# EAGLE design board (EAGLE 6.1)
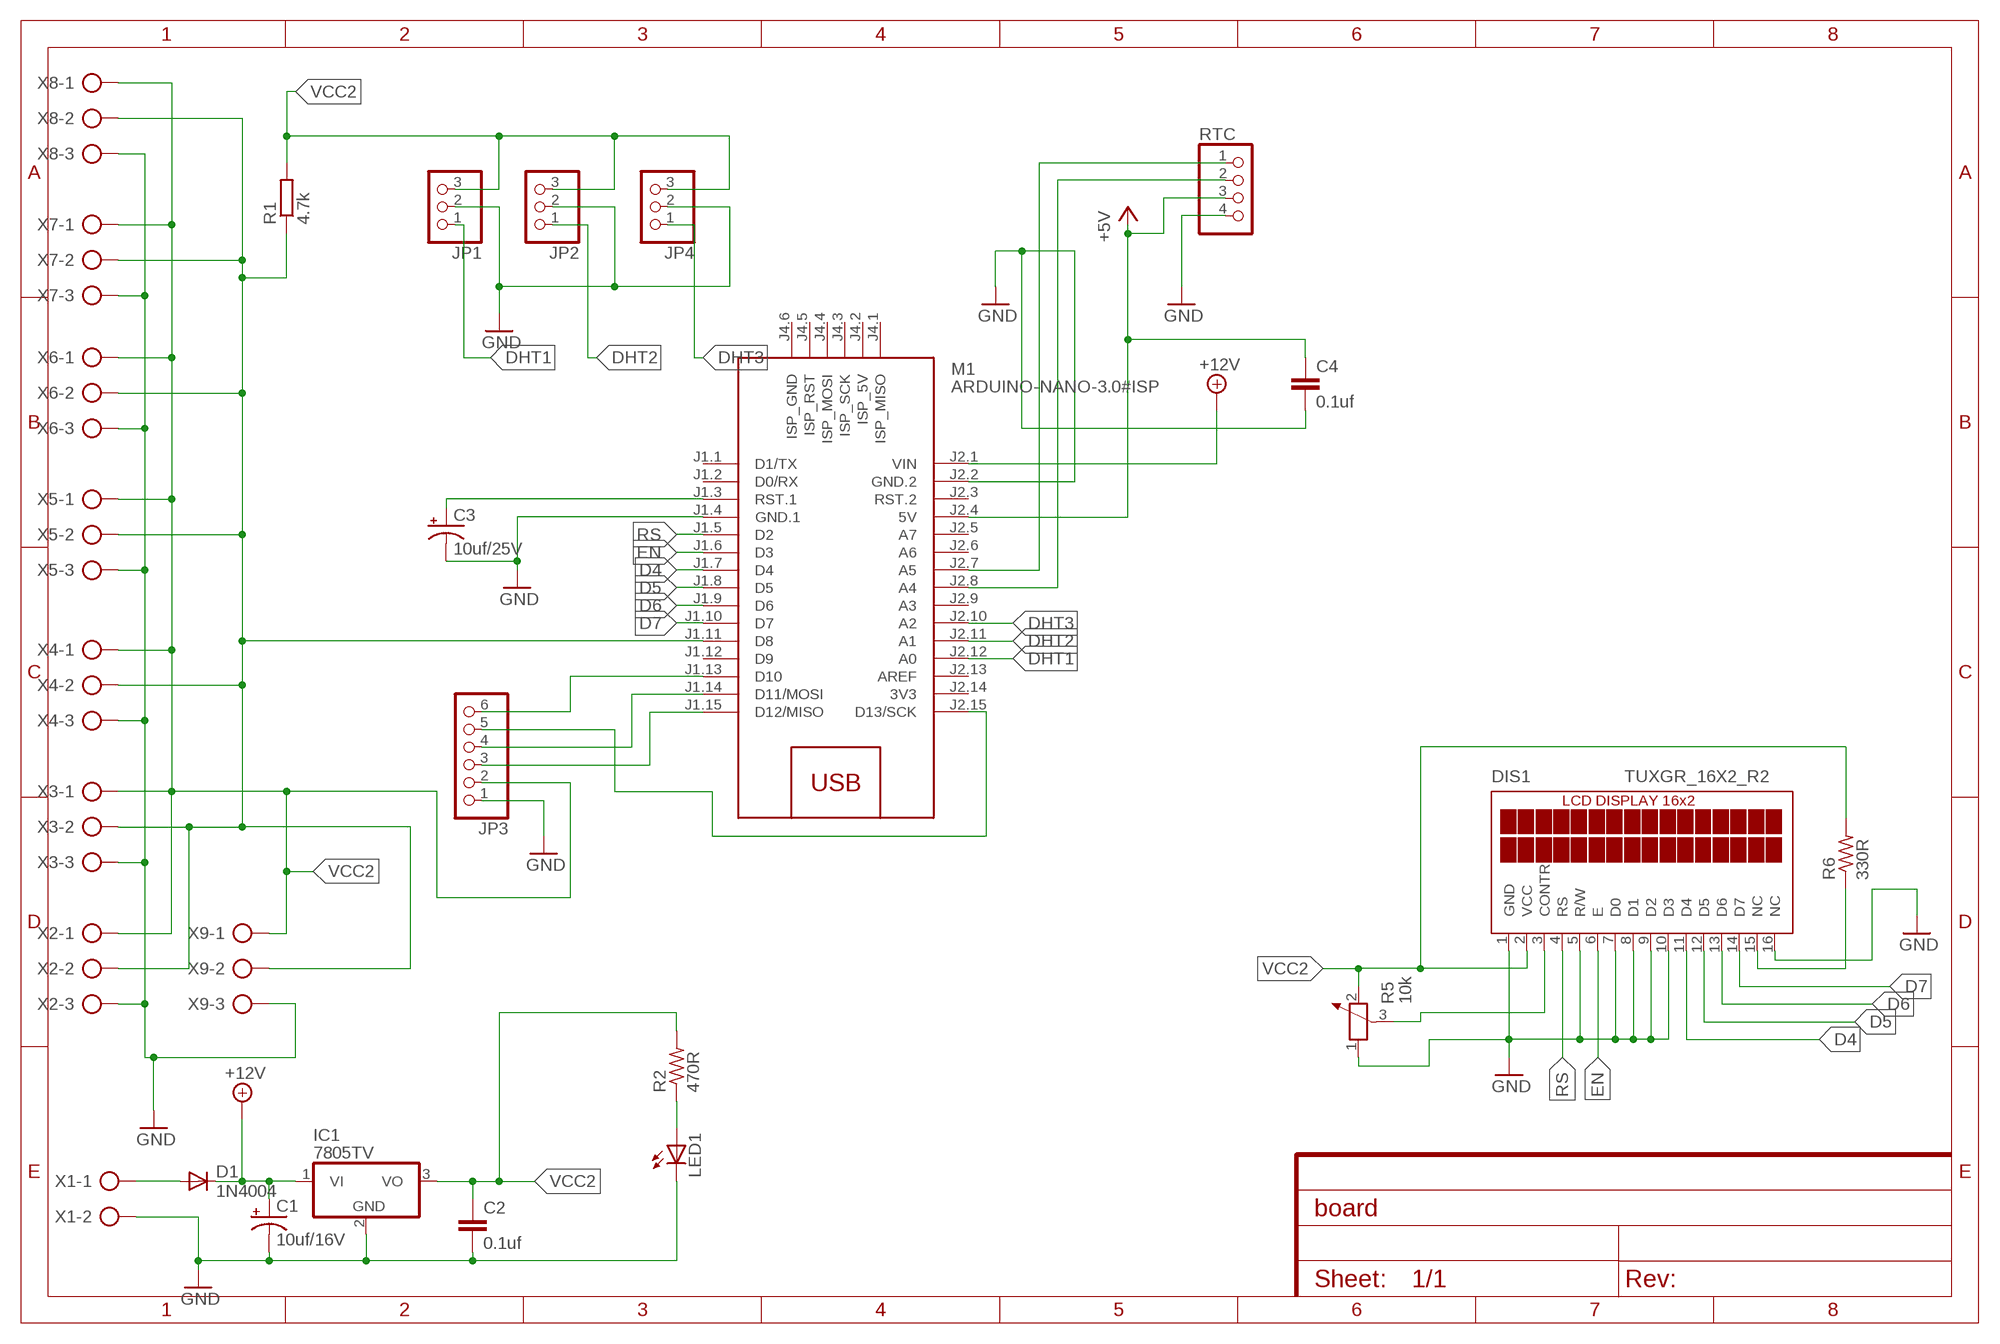
[diagram p0: schematic, sheet 1]
FRAME1 (FRAME-A4L): CNAME: DATA LOGGER NANO RTC

## Parts
C1  10uf/16V  CPOL-USE2.5-5  [E2,5-5]
C2  0.1uf  C-EU050-035X075  [C050-035X075]
C3  10uf/25V  CPOL-USE2.5-5  [E2,5-5]
C4  0.1uf  C-EU050-035X075  [C050-035X075]
D1  1N4004  [DO41-10]
DIS1  TUXGR_16X2_R2  [TUXGR_16X2_R2]
IC1  7805TV  [TO220V]
JP1  PINHD-1X3  [1X03]
JP2  PINHD-1X3  [1X03]
JP3  PINHD-1X6  [1X06]
JP4  PINHD-1X3  [1X03]
LED1  LED3MM  [LED3MM]
M1  ARDUINO-NANO-3.0#ISP  [ARDUINO-NANO-3.0#ISP]
R1  4.7k  R-EU_0207/10  [0207/10]
R2  470R  R-US_0207/10  [0207/10@1]
R5  10k  POTENTIOMETER_PT-10  [PT-10]
R6  330R  R-US_0207/10  [0207/10@1]
RTC  PINHD-1X4  [1X04]
X1  AK500/2  [AK500/2]
X2  AK500/3  [AK500/3]
X3  AK500/3  [AK500/3]
X4  AK500/3  [AK500/3]
X5  AK500/3  [AK500/3]
X6  AK500/3  [AK500/3]
X7  AK500/3  [AK500/3]
X8  AK500/3  [AK500/3]
X9  AK500/3  [AK500/3]

## Nets
+5V: C4.1 M1.J2.4(5V) RTC.3
+12V: C1.+ D1.C IC1.1(VI) M1.J2.1(VIN)
D4: DIS1.11(D4) M1.J1.7(D4)
D5: DIS1.12(D5) M1.J1.8(D5)
D6: DIS1.13(D6) M1.J1.9(D6)
D7: DIS1.14(D7) M1.J1.10(D7)
DHT1: JP1.1 M1.J2.12(A0)
DHT2: JP2.1 M1.J2.11(A1)
DHT3: JP4.1 M1.J2.10(A2)
EN: DIS1.6(E) M1.J1.6(D3)
GND: C1.- C2.2 C3.- C4.2 DIS1.1(GND) DIS1.5(R/W) DIS1.7(D0) DIS1.8(D1) DIS1.9(D2) DIS1.10(D3) DIS1.16(NC) IC1.2(GND) JP1.2 JP2.2 JP3.1 JP4.2 LED1.K(C) M1.J1.4(GND.1) M1.J2.2(GND.2) R5.1 RTC.4 X1.2 X2.3 X3.3 X4.3 X5.3 X6.3 X7.3 X8.3 X9.3
N$2: D1.A X1.1
N$3: C3.+ M1.J1.3(RST.1)
N$6: JP1.3 JP2.3 JP4.3 R1.2
N$7: M1.J2.7(A5) RTC.1
N$8: M1.J2.8(A4) RTC.2
N$9: M1.J1.11(D8) R1.1 X2.2 X3.2 X4.2 X5.2 X6.2 X7.2 X8.2 X9.2
N$10: DIS1.3(CONTR) R5.3
N$11: DIS1.15(NC) R6.1
N$14: JP3.3 M1.J1.15(D12/MISO)
N$15: JP3.4 M1.J1.14(D11/MOSI)
N$16: JP3.5 M1.J2.15(D13/SCK)
N$17: JP3.6 M1.J1.13(D10)
N$18: LED1.A R2.1
RS: DIS1.4(RS) M1.J1.5(D2)
VCC2: C2.1 DIS1.2(VCC) IC1.3(VO) JP3.2 R2.2 R5.2 R6.2 X2.1 X3.1 X4.1 X5.1 X6.1 X7.1 X8.1 X9.1
Unconnected: M1.J1.1(D1/TX) M1.J1.2(D0/RX) M1.J1.12(D9) M1.J2.3(RST.2) M1.J2.5(A7) M1.J2.6(A6) M1.J2.9(A3) M1.J2.13(AREF) M1.J4.1(ISP_MISO) M1.J4.2(ISP_5V) M1.J4.3(ISP_SCK) M1.J4.4(ISP_MOSI) M1.J4.5(ISP_RST) M1.J4.6(ISP_GND)

## Power pins joined to a net without a drawn wire
3V3: M1.J2.14(3V3)

## Library data of the parts
C1 C3 = rcl:CPOL-US: POLARIZED CAPACITOR, American symbol
C2 C4 = rcl:C-EU: CAPACITOR, European symbol
D1 = diode:1N4004: DIODE general purpose rectifier, 1 A
DIS1 = display-lcd:TUXGR_16X2_R2: Tuxgraphics LCD display 16x2 characters reflective, without background light Source: tuxgr_12x2_r2.pdf; OC_FARNELL: unknown; OC_NEWARK: unknown
IC1 = linear:78*: Positive VOLTAGE REGULATOR Source: http://cache.national.com/ds/LM/LM78L05.pdf http://www.fairchildsemi.com/ds/LM/LM7805.pdf
JP1 JP2 JP4 = pinhead:PINHD-1X3: PIN HEADER
JP3 = pinhead:PINHD-1X6: PIN HEADER
LED1 = led:LED: LED OSRAM: - CHIPLED LG R971, LG N971, LY N971, LG Q971, LY Q971, LO R971, LY R971 LH N974, LH R974 LS Q976, LO Q976, LY Q976 LO Q996 - Hyper CHIPLED LW Q18S LB Q993, LB Q99A, LB R99A - SideLED LS A670, LO A670, LY A670, LG A670, LP A670 LB A673, LV A673, LT A673, LW A673 LH A674 LY A675 LS A676, LA A676, LO A676, LY A676, LW A676 LS A679, LY A679, LG A679 - Hyper Micro SIDELED® LS Y876, LA Y876, LO Y876, LY Y876 LT Y87S - SmartLED LW L88C, LW L88S LB L89C, LB L89S, LG L890 LS L89K, LO L89K, LY L89K LS L896, LA L896, LO L896, LY L896 - TOPLED LS T670, LO T670, LY T670, LG T670, LP T670 LSG T670, LSP T670, LSY T670, LOP T670, LYG T670 LG T671, LOG T671, LSG T671 LB T673, LV T673, LT T673, LW T673 LH T674 LS T676, LA T676, LO T676, LY T676, LB T676, LH T676, LSB T676, LW T676 LB T67C, LV T67C, LT T67C, LS T67K, LO T67K, LY T67K, LW E67C LS E67B, LA E67B, LO E67B, LY E67B, LB E67C, LV E67C, LT E67C LW T67C LS T679, LY T679, LG T679 LS T770, LO T770, LY T770, LG T770, LP T770 LB T773, LV T773, LT T773, LW T773 LH T774 LS E675, LA E675, LY E675, LS T675 LS T776, LA T776, LO T776, LY T776, LB T776 LHGB T686 LT T68C, LB T68C - Hyper Mini TOPLED® LB M676 - Mini TOPLED Santana® LG M470 LS M47K, LO M47K, LY M47K Source: http://www.osram.convergy.de LUXEON: - LUMILED® LXK2-PW12-R00, LXK2-PW12-S00, LXK2-PW14-U00, LXK2-PW14-V00 LXK2-PM12-R00, LXK2-PM12-S00, LXK2-PM14-U00 LXK2-PE12-Q00, LXK2-PE12-R00, LXK2-PE12-S00, LXK2-PE14-T00, LXK2-PE14-U00 LXK2-PB12-K00, LXK2-PB12-L00, LXK2-PB12-M00, LXK2-PB14-N00, LXK2-PB14-P00, LXK2-PB14-Q00 LXK2-PR12-L00, LXK2-PR12-M00, LXK2-PR14-Q00, LXK2-PR14-R00 LXK2-PD12-Q00, LXK2-PD12-R00, LXK2-PD12-S00 LXK2-PH12-R00, LXK2-PH12-S00 LXK2-PL12-P00, LXK2-PL12-Q00, LXK2-PL12-R00 Source: www.luxeon.com KINGBRIGHT: KA-3528ASYC Source: www.kingbright.com
M1 = diy-modules:ARDUINO-NANO-3.0#ISP: Arduino Nano 3.0 (and compatible devices) with ISP pads More details available here: https://www.arduino.cc/en/Main/ArduinoBoardNano Click here to find device on ebay.com <http://www.ebay.com/sch/arduino+nano>
R1 = rcl:R-EU_: RESISTOR, European symbol
R2 R6 = rcl:R-US_: RESISTOR, American symbol
R5 = rcl:POTENTIOMETER_: Potentiometer
RTC = pinhead:PINHD-1X4: PIN HEADER
X1 = con-ptr500:AK500/2: CONNECTOR; OC_FARNELL: unknown; OC_NEWARK: unknown
X2-X9 = con-ptr500:AK500/3: CONNECTOR; OC_FARNELL: unknown; OC_NEWARK: unknown

## Net classes
0 default: width 2 mm, drill 0.8 mm, clearance 0.8 mm

## Board
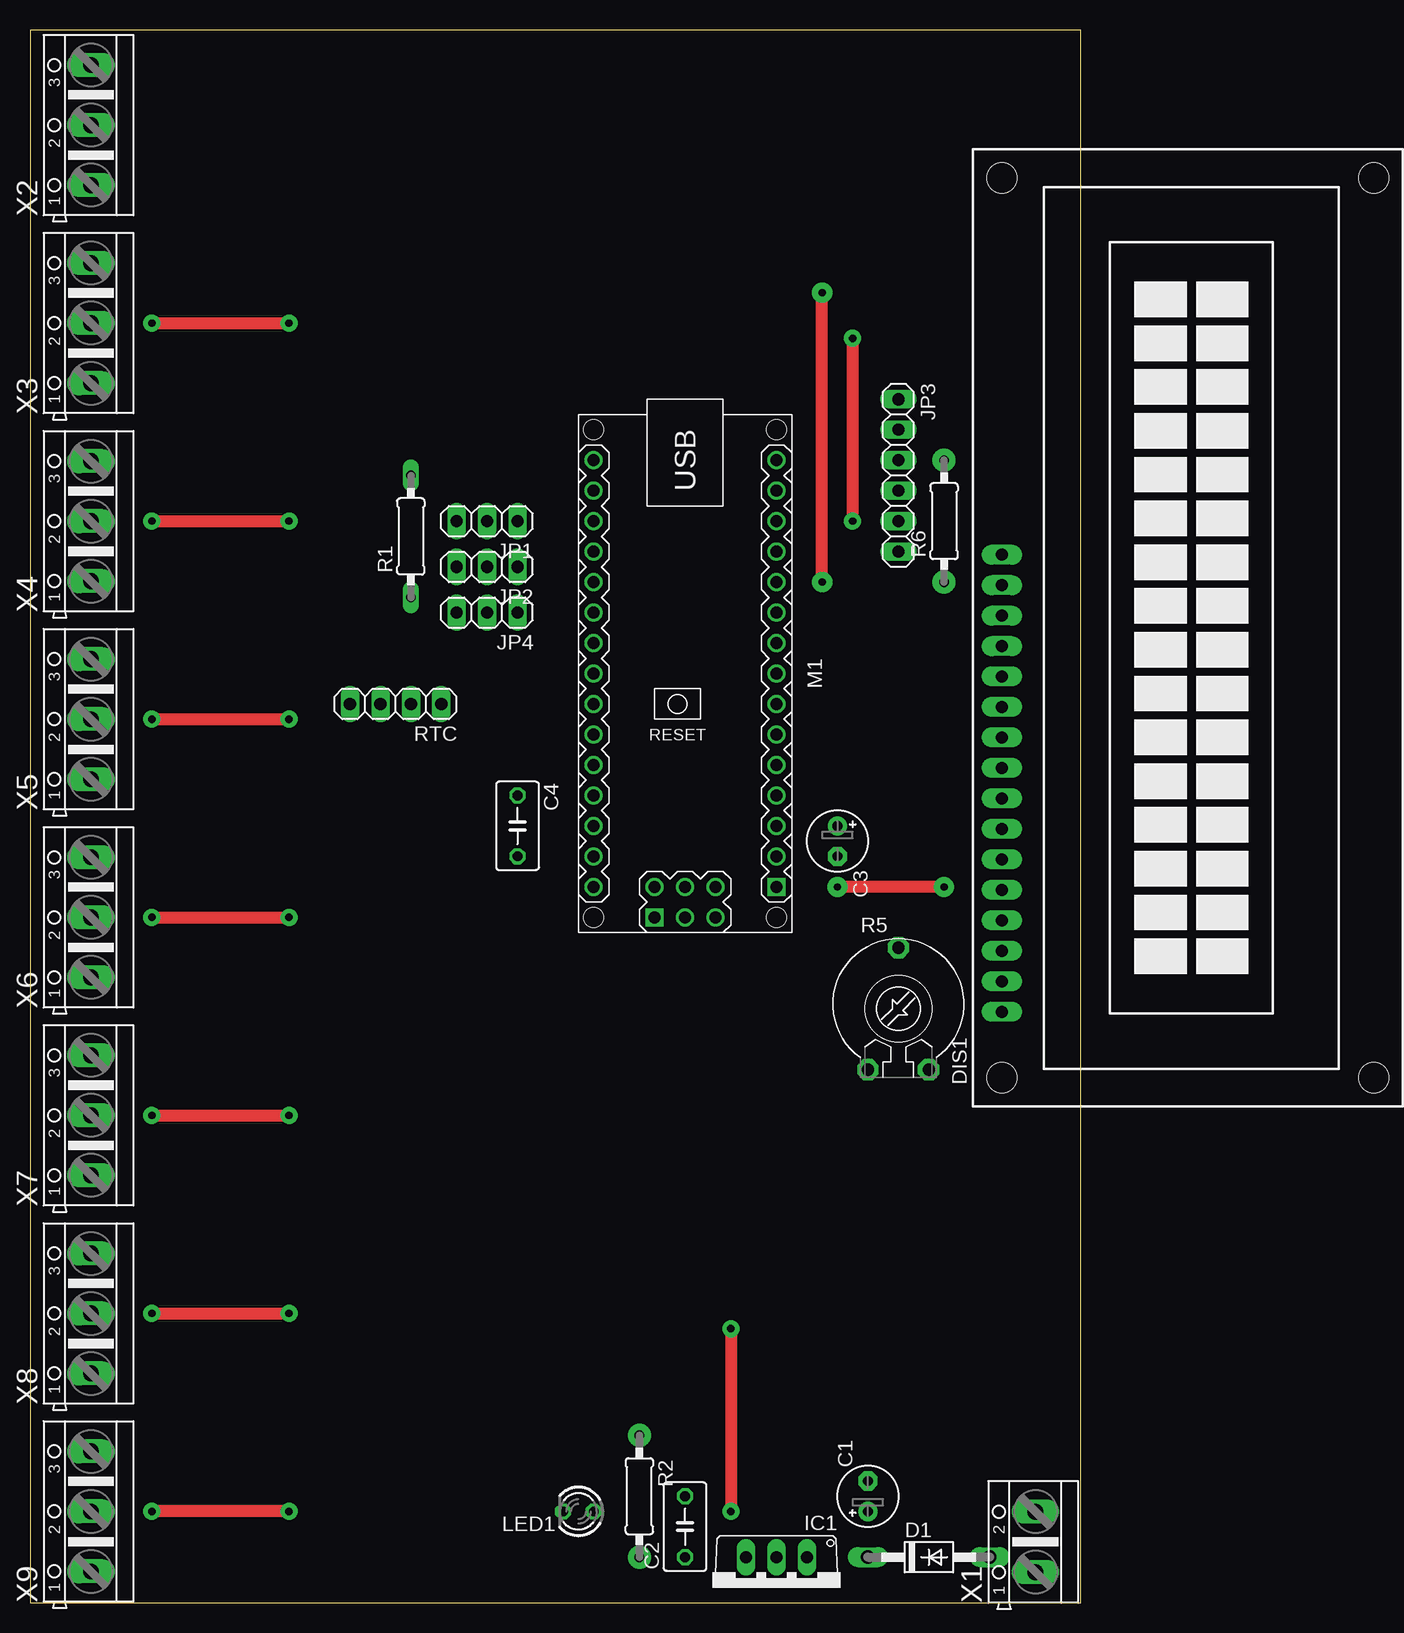
[diagram p1: board, top side]
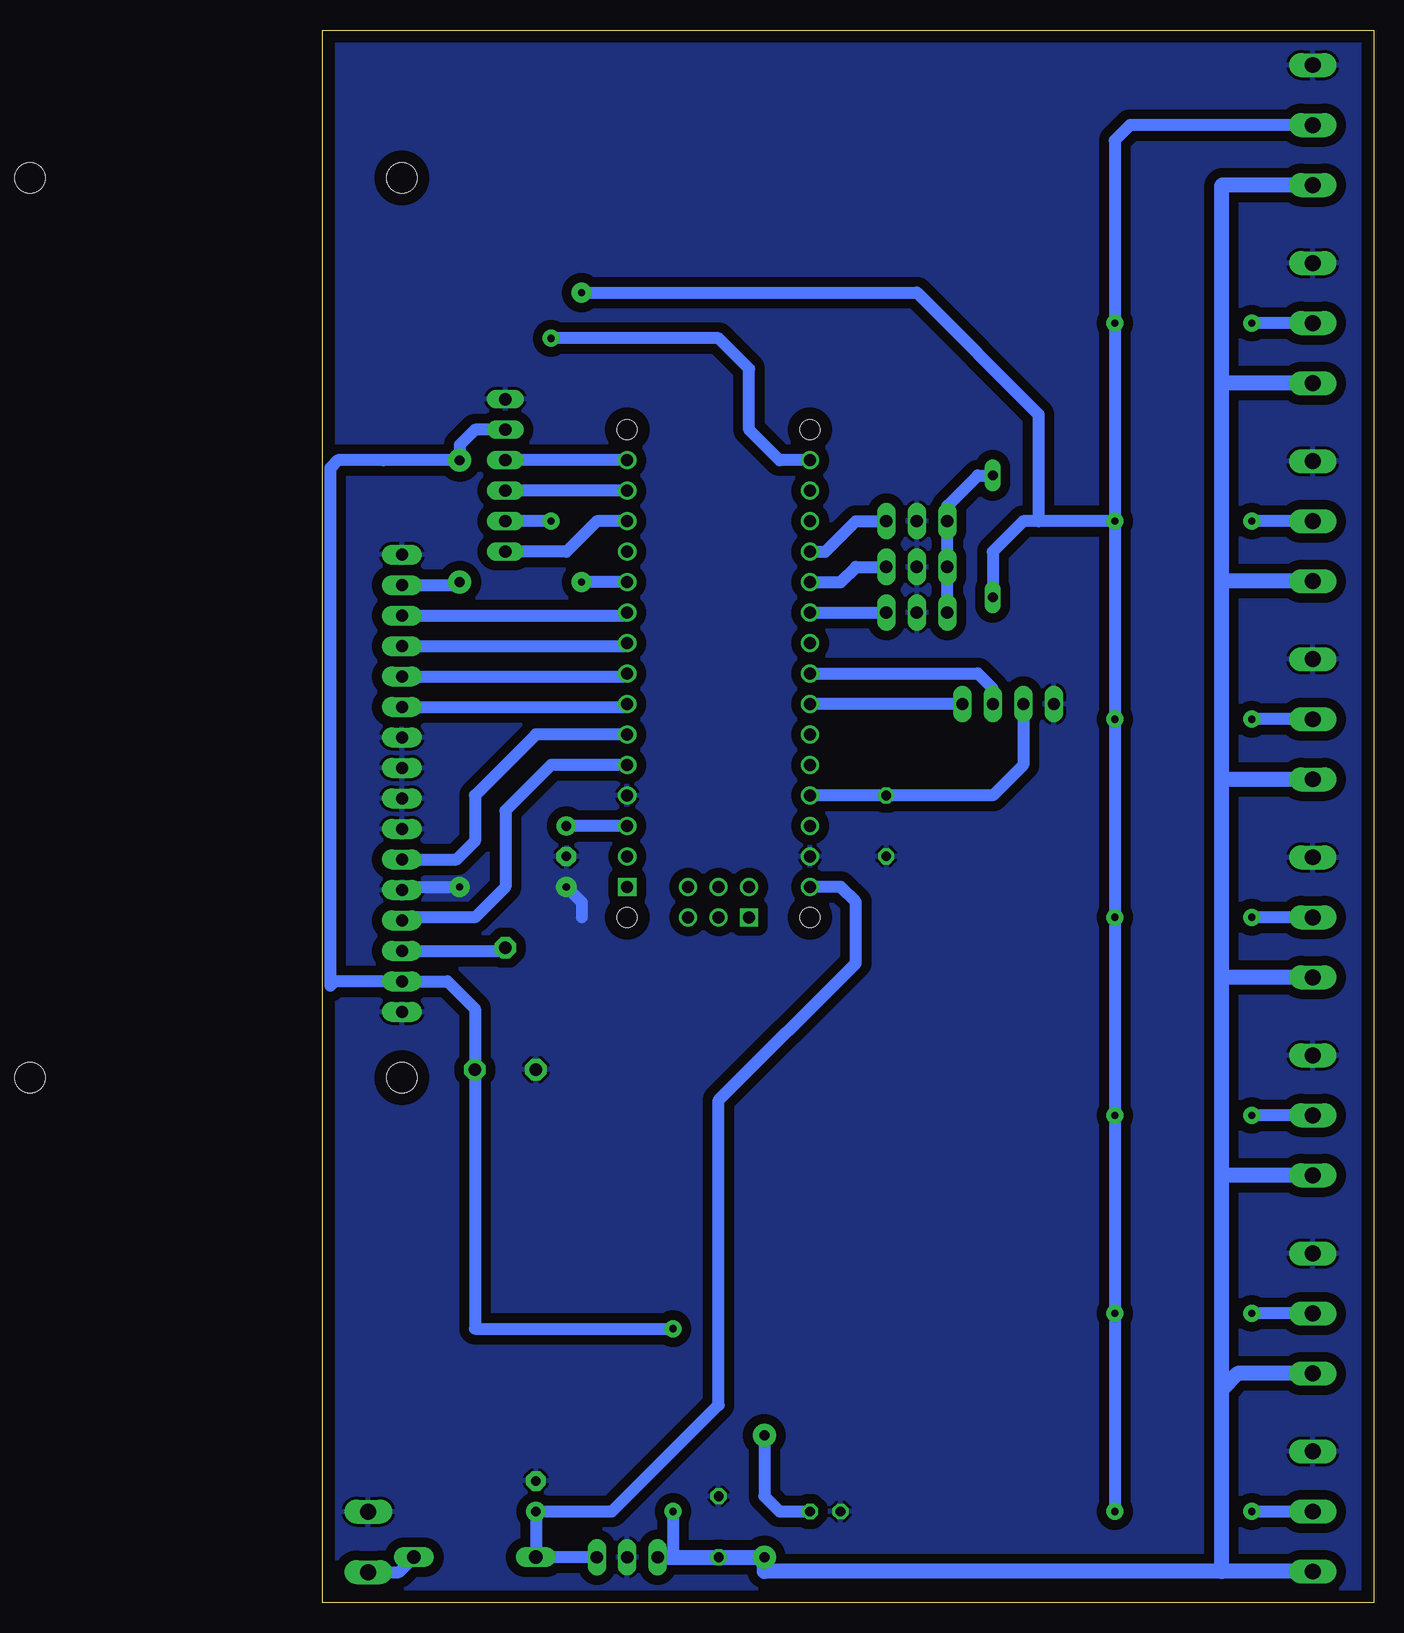
[diagram p2: board, bottom side, seen from below]

Size 87.61 x 131.12 mm. Coordinates in mm from the lower left corner, seen from the top.
Outline: 0,0 87.61,0 87.61,131.12 0,131.12 0,0
Copper layers (1*16): Top 0.035mm / dielectric 1.5mm / Bottom 0.035mm
Design rules: minimum track width 10mil, minimum drill 24mil, track to track 8mil, track to pad 8mil, pad to pad 8mil, via to via 8mil, smd to smd 8mil, copper to edge 40mil, drill to drill 8mil, minimum pad ring 10mil, minimum via ring 8mil, stop-mask expansion 4mil, vias tented up to drill 0mil, thermal gap 10mil

### Footprints (pad centres in the part's own frame; a part is rotated, then mirrored left to right if it is on the bottom)
E2,5-5 = drill 0.813 pad 1.6: + -1.27,0 | drill 0.813 pad 1.6 octagon: - 1.27,0
C050-035X075 = drill 0.813 octagon: 1 -2.54,0; 2 2.54,0
DO41-10 = drill 1.118 long: A 5.08,0; C -5.08,0
TUXGR_16X2_R2 = drill 1 pad 1.676 long: 1 -32,15.5; 2 -29.46,15.5; 3 -26.92,15.5; 4 -24.38,15.5; 5 -21.84,15.5; 6 -19.3,15.5; 7 -16.76,15.5; 8 -14.22,15.5; 9 -11.68,15.5; 10 -9.14,15.5; 11 -6.6,15.5; 12 -4.06,15.5; 13 -1.52,15.5; 14 1.02,15.5; 15 3.56,15.5; 16 6.1,15.5 | hole 2.5: -37.5,-15.5; 37.5,-15.5; -37.5,15.5; 37.5,15.5
TO220V = drill 1.016 long: 1 -2.54,-2.54; 2 0,-2.54; 3 2.54,-2.54
1X03 = drill 1.016 long: 1 -2.54,0; 2 0,0; 3 2.54,0
1X06 = drill 1.016 long: 1 -6.35,0; 2 -3.81,0; 3 -1.27,0; 4 1.27,0; 5 3.81,0; 6 6.35,0
LED3MM = drill 0.813 octagon: A -1.27,0; K 1.27,0
ARDUINO-NANO-3.0#ISP = drill 1 square: J1.1 17.78,7.62; J4.1 20.32,-2.54 | drill 1: J1.2 15.24,7.62; J1.3 12.7,7.62; J1.4 10.16,7.62; J1.5 7.62,7.62; J1.6 5.08,7.62; J1.7 2.54,7.62; J1.8 0,7.62; J1.9 -2.54,7.62; J1.10 -5.08,7.62; J1.11 -7.62,7.62; J1.12 -10.16,7.62; J1.13 -12.7,7.62; J1.14 -15.24,7.62; J1.15 -17.78,7.62; J2.1 17.78,-7.62; J2.2 15.24,-7.62; J2.3 12.7,-7.62; J2.4 10.16,-7.62; J2.5 7.62,-7.62; J2.6 5.08,-7.62; J2.7 2.54,-7.62; J2.8 0,-7.62; J2.9 -2.54,-7.62; J2.10 -5.08,-7.62; J2.11 -7.62,-7.62; J2.12 -10.16,-7.62; J2.13 -12.7,-7.62; J2.14 -15.24,-7.62; J2.15 -17.78,-7.62; J4.2 17.78,-2.54; J4.3 20.32,0; J4.4 17.78,0; J4.5 20.32,2.54; J4.6 17.78,2.54 | hole 1.651: -20.32,7.62; -20.32,-7.62; 20.32,-7.62; 20.32,7.62
0207/10 = drill 0.813 pad 1.27 long: 1 -5.08,0; 2 5.08,0
0207/10@1 = drill 0.813 pad 1.93: 1 -5.08,0; 2 5.08,0
PT-10 = drill 1.016 pad 1.778 octagon: 1 -2.54,-5.08; 2 2.54,-5.08; 3 0,5.08
1X04 = drill 1.016 long: 1 -3.81,0; 2 -1.27,0; 3 1.27,0; 4 3.81,0
AK500/2 = drill 1.321 long: 1 -2.515,0; 2 2.515,0
AK500/3 = drill 1.321 long: 1 -5.004,0; 2 0,0; 3 5.004,0

### Placement (x,y rotation side)
C1  69.85,8.89 90 top
C2  54.61,6.35 90 top
C3  67.31,63.5 270 top
C4  40.64,64.77 270 top
D1  74.93,3.81 0 top
DIS1  96.52,81.28 90 top
IC1  62.23,1.27 180 top
JP1  38.1,90.17 180 top
JP2  38.1,86.36 180 top
JP3  72.39,93.98 270 top
JP4  38.1,82.55 180 top
LED1  45.72,7.62 180 top
M1  54.61,77.47 270 top
R1  31.75,88.9 90 top
R2  50.8,8.89 270 top
R5  72.39,49.53 0 top
R6  76.2,90.17 90 top
RTC  30.48,74.93 180 top
X1  83.82,5.08 90 top
X2  5.08,123.19 90 top
X3  5.08,106.68 90 top
X4  5.08,90.17 90 top
X5  5.08,73.66 90 top
X6  5.08,57.15 90 top
X7  5.08,40.64 90 top
X8  5.08,24.13 90 top
X9  5.08,7.62 90 top

### Tracks (layer width: path | path; a pad name or v marks a point on that pad's centre or on a via)
+5V
  Bottom 1.016: RTC.3 29.21,69.85 31.75,67.31 C4.1 M1.J2.4
+12V
  Bottom 1.016: IC1.1 D1.C C1.+ 63.5,7.62 54.61,16.51 54.61,41.91 43.18,53.34 43.18,58.42 44.45,59.69 M1.J2.1
D4
  Bottom 1.016: DIS1.11 62.48,74.68 M1.J1.7
D5
  Bottom 1.016: DIS1.12 62.48,77.22 M1.J1.8
D6
  Bottom 1.016: DIS1.13 62.48,79.76 M1.J1.9
D7
  Bottom 1.016: DIS1.14 62.48,82.3 M1.J1.10
DHT1
  Bottom 1.016: M1.J2.12 45.72,87.63 43.18,90.17 JP1.1
DHT2
  Bottom 1.016: M1.J2.11 44.45,85.09 43.18,86.36 JP2.1
DHT3
  Bottom 1.016: M1.J2.10 JP4.1
EN
  Bottom 1.016: M1.J1.6 69.85,72.39 74.93,67.31 74.93,63.5 76.45,61.98 DIS1.6
GND  (via drill 0.6 pad 1.68)
  Top 1.016: v76.2,59.69 v67.31,59.69
  Bottom 1.016: DIS1.5 80.77,59.69 v76.2,59.69 | v67.31,59.69 66.04,58.42 66.04,57.15
  pour Bottom: 0,130.81 0,0 87.63,0 87.63,130.81
N$2
  Bottom 1.016: X1.1 81.25,2.56 D1.A
N$3
  Bottom 1.016: M1.J1.3 C3.+
N$6
  Bottom 1.016: JP4.3 JP2.3 JP1.3 35.56,91.44 33.02,93.98 R1.2
N$7
  Bottom 1.016: RTC.1 M1.J2.7
N$8
  Bottom 1.016: M1.J2.8 33.02,77.47 31.75,76.2 RTC.2
N$9  (via drill 0.6 pad 1.42, 0.6 pad 1.68)
  Top 1.016: v21.59,7.62 v10.16,7.62 | v10.16,106.68 v21.59,106.68 | v10.16,90.17 v21.59,90.17 | v10.16,73.66 v21.59,73.66 | v10.16,57.15 v21.59,57.15 | v10.16,40.64 v21.59,40.64 | v10.16,24.13 v21.59,24.13 | v66.04,85.09 v66.04,109.22
  Bottom 1.016: X2.2 20.32,123.19 21.59,121.92 v21.59,106.68 v21.59,90.17 | v21.59,90.17 v21.59,73.66 v21.59,57.15 v21.59,40.64 v21.59,24.13 v21.59,7.62 | v10.16,7.62 X9.2 | X3.2 v10.16,106.68 | X4.2 v10.16,90.17 | X5.2 v10.16,73.66 | X6.2 v10.16,57.15 | X7.2 v10.16,40.64 | X8.2 v10.16,24.13 | v21.59,90.17 27.94,90.17 | 27.94,90.17 29.21,90.17 31.75,87.63 R1.1 | M1.J1.11 v66.04,85.09 | v66.04,109.22 38.1,109.22 27.94,99.06 27.94,90.17
N$10
  Bottom 1.016: DIS1.3 72.64,54.36 R5.3
N$11
  Bottom 1.016: DIS1.15 76.45,84.84 R6.1
N$14
  Bottom 1.016: M1.J1.15 JP3.3
N$15
  Bottom 1.016: M1.J1.14 JP3.4
N$16  (via drill 0.6 pad 1.42)
  Top 1.016: v68.58,105.41 v68.58,90.17
  Bottom 1.016: M1.J2.15 49.53,95.25 52.07,97.79 52.07,102.87 54.61,105.41 v68.58,105.41 | v68.58,90.17 JP3.5
N$17
  Bottom 1.016: M1.J1.13 64.77,90.17 67.31,87.63 JP3.6
N$18
  Bottom 1.016: R2.1 50.8,8.89 49.53,7.62 LED1.A
RS
  Bottom 1.016: M1.J1.5 68.58,69.85 72.39,66.04 72.39,59.69 74.93,57.15 80.77,57.15 DIS1.4
VCC2  (via drill 0.6 pad 1.42)
  Top 1.016: v58.42,22.86 v58.42,7.62
  Bottom 1.016: JP3.2 74.93,97.79 76.2,96.52 R6.2 | v58.42,22.86 74.93,22.86 R5.2 74.93,49.53 77.22,51.82 DIS1.2 86.61,51.82 86.99,51.44 86.99,94.61 86.36,95.25 R6.2 | v58.42,7.62 58.42,3.81 | R6.2 82.55,95.25
  Bottom 1.27: X9.1 12.7,2.62 | 12.7,2.62 50.8,2.62 R2.2 C2.1 58.42,3.81 IC1.3 | X8.1 11.35,19.13 12.7,17.78 | 12.7,17.78 12.7,2.62 | X2.1 12.62,118.19 12.7,118.11 12.7,101.6 | 12.7,101.6 12.7,85.09 | 12.7,85.09 12.7,68.58 | 12.7,68.58 12.7,52.07 | 12.7,52.07 12.7,35.56 | 12.7,35.56 12.7,17.78 | X3.1 12.62,101.68 12.7,101.6 | X4.1 12.62,85.17 12.7,85.09 | X5.1 12.62,68.66 12.7,68.58 | X6.1 12.62,52.15 12.7,52.07 | X7.1 12.62,35.64 12.7,35.56